# EAGLE design Platform (EAGLE 6.1)
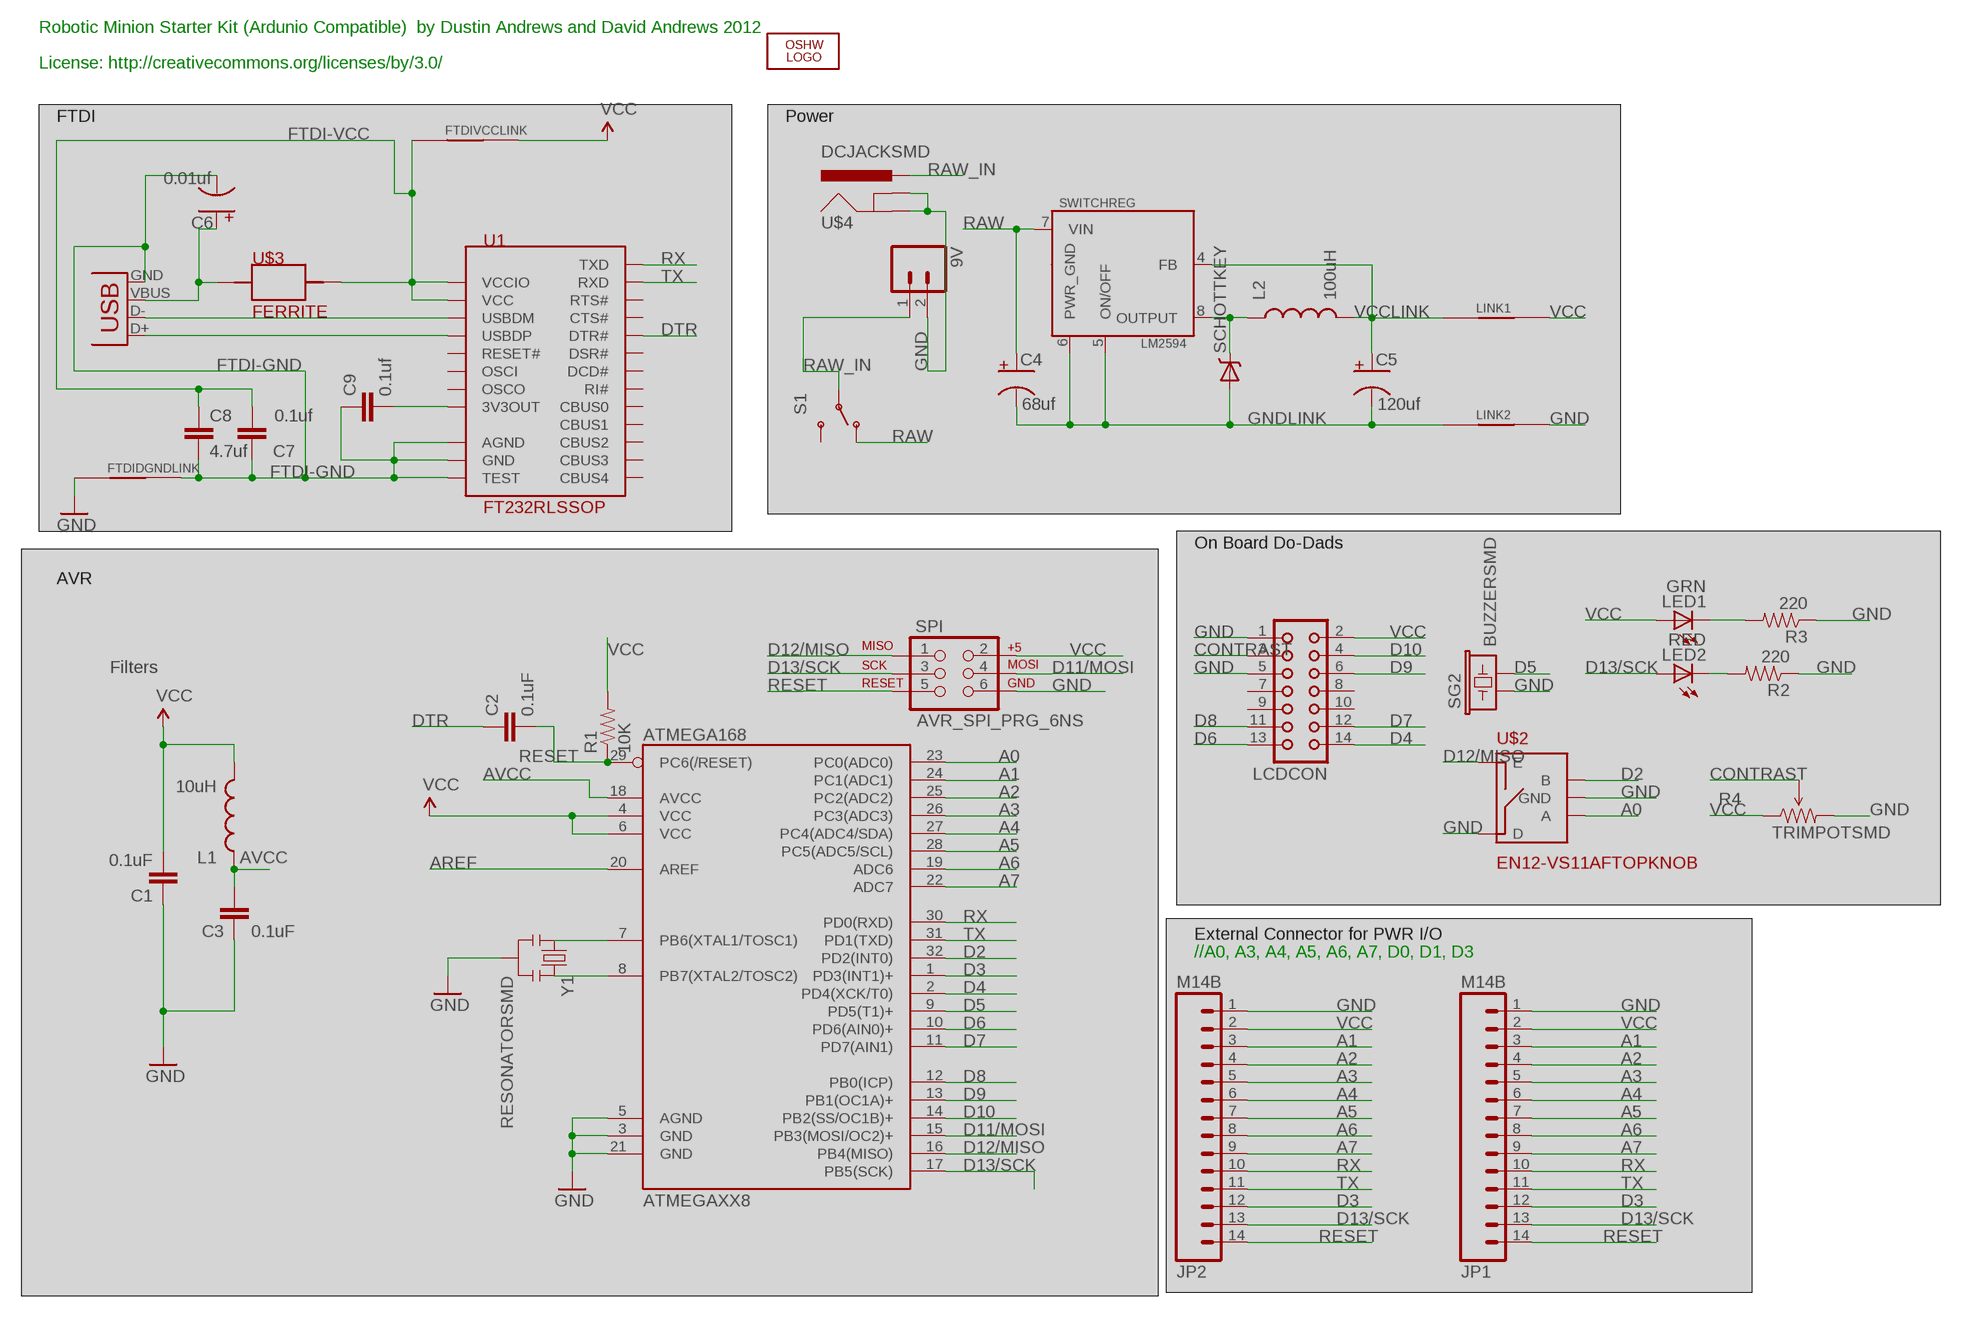
[diagram p0: schematic, sheet 1]

## Parts
9V  M02PTH  [1X02]
ATMEGAXX8  ATMEGA168  [TQFP32-08]
C1  0.1uF  CAP0805  [0805]
C2  0.1uF  CAP0805  [0805]
C3  0.1uF  CAP0805  [0805]
C4  68uf  CAP_POLF80  [F80]
C5  120uf  CAP_POL8X10  [10X8CAP]
C6  0.01uf  CAP_POL  [0805POL]
C7  0.1uf  CAP0805  [0805]
C8  4.7uf  CAP0805  [0805]
C9  0.1uf  CAP0805  [0805]
FTDIDGNDLINK  LINK  [ISOLATOR]
FTDIVCCLINK  LINK  [ISOLATOR]
JP1  M14B  [1X14B]
JP2  M14B  [1X14B]
L1  10uH  INDUCTOR0805  [0805]
L2  100uH  INDUCTOR0805  [0805]
LCDCON  CON14  [CON14]
LED1  GRN  LED0805  [LED-0805]
LED2  RED  LED0805  [LED-0805]
LINK1  LINK  [ISOLATOR]
LINK2  LINK  [ISOLATOR]
LOGO1  OSHW_LOGO_10MILX0750-NT  [OSHW_10X750_NOTEXT]
R1  10K  RESISTOR0805-RES  [0805]
R2  220  RESISTOR0805-RES  [0805]
R3  220  RESISTOR0805-RES  [0805]
R4  TRIMPOTSMD  [TRIMPOT-3MM]
S1  SWITCH-SPDT  [SWITCH-SPDT-SMT]
SCHOTTKEY  DIODE-SCHOTTKY  [SOD-123]
SG2  BUZZERSMD  [BUZZER-CMT1603]
SPI  AVR_SPI_PRG_6NS  [2X3-NS]
SWITCHREG  LM2594  [SOIC8]
U1  FT232RLSSOP  [SSOP28]
U$2  EN12-VS11AFTOPKNOB  [12MM_ROTATY_TOP]
U$3  FERRITE  [0805]
U$4  DCJACKSMD  [JACK-SMD]
X1  USBSMD  [USB-MINIB]
Y1  RESONATORSMD  [RESONATOR-SMD]

## Nets
3V3OUT: C9.2 U1.17(3V3OUT)
A0: ATMEGAXX8.23(PC0(ADC0)) U$2.A
A1: ATMEGAXX8.24(PC1(ADC1)) JP1.3 JP2.3
A2: ATMEGAXX8.25(PC2(ADC2)) JP1.4 JP2.4
A3: ATMEGAXX8.26(PC3(ADC3)) JP1.5 JP2.5
A4: ATMEGAXX8.27(PC4(ADC4/SDA)) JP1.6 JP2.6
A5: ATMEGAXX8.28(PC5(ADC5/SCL)) JP1.7 JP2.7
A6: ATMEGAXX8.19(ADC6) JP1.8 JP2.8
A7: ATMEGAXX8.22(ADC7) JP1.9 JP2.9
AREF: ATMEGAXX8.20(AREF)
AVCC: ATMEGAXX8.18(AVCC) C3.2 L1.1
CONTRAST: LCDCON.3 R4.2(WIPER)
D2: ATMEGAXX8.32(PD2(INT0)) U$2.B
D3: ATMEGAXX8.1(PD3(INT1)+) JP1.12 JP2.12
D4: ATMEGAXX8.2(PD4(XCK/T0)) LCDCON.14
D5: ATMEGAXX8.9(PD5(T1)+) SG2.P$2
D6: ATMEGAXX8.10(PD6(AIN0)+) LCDCON.13
D7: ATMEGAXX8.11(PD7(AIN1)) LCDCON.12
D8: ATMEGAXX8.12(PB0(ICP)) LCDCON.11
D9: ATMEGAXX8.13(PB1(OC1A)+) LCDCON.6
D10: ATMEGAXX8.14(PB2(SS/OC1B)+) LCDCON.4
D11/MOSI: ATMEGAXX8.15(PB3(MOSI/OC2)+) SPI.4
D12/MISO: ATMEGAXX8.16(PB4(MISO)) SPI.1 U$2.E
D13/SCK: ATMEGAXX8.17(PB5(SCK)) JP1.13 JP2.13 LED2.A SPI.3
D+: U1.15(USBDP) X1.D+
D-: U1.16(USBDM) X1.D-
DTR: C2.1 U1.2(DTR#)
FTDI-GND: C6.- C7.1 C8.2 C9.1 FTDIDGNDLINK.P$2 U1.7(GND) U1.18(GND) U1.21(GND) U1.25(AGND) U1.26(TEST) X1.GND
FTDI-VCC: C7.2 C8.1 FTDIVCCLINK.P$1 U1.4(VCCIO) U1.20(VCC) U$3.2
GND: 9V.2 ATMEGAXX8.3(GND) ATMEGAXX8.5(AGND) ATMEGAXX8.21(GND) C1.1 C3.1 FTDIDGNDLINK.P$1 JP1.1 JP2.1 LCDCON.1 LCDCON.5 LINK2.P$2 R2.1 R3.1 R4.3(CW) SG2.P$1 SPI.6 U$2.C(GND) U$2.D U$4.1A(GND) U$4.1B(GNDBREAK) Y1.2
GNDLINK: C4.- C5.- LINK2.P$1 SCHOTTKEY.ANODE(A) SWITCHREG.5(ON/OFF) SWITCHREG.6(PWR_GND)
N$2: LED2.C R2.2
N$3: L2.1 SCHOTTKEY.CATHODE(C) SWITCHREG.8(OUTPUT)
N$7: LED1.C R3.2
RAW: C4.+ S1.1(O) SWITCHREG.7(VIN)
RAW_IN: 9V.1 S1.2(P) U$4.2(PWR) U$4.3(PWR)
RESET: ATMEGAXX8.29(PC6(/RESET)) C2.2 JP1.14 JP2.14 R1.1 SPI.5
RX: ATMEGAXX8.30(PD0(RXD)) JP1.10 JP2.10 U1.1(TXD)
TX: ATMEGAXX8.31(PD1(TXD)) JP1.11 JP2.11 U1.5(RXD)
VBUS: C6.+ U$3.1 X1.VBUS
VCC: ATMEGAXX8.4(VCC) ATMEGAXX8.6(VCC) C1.2 FTDIVCCLINK.P$2 JP1.2 JP2.2 L1.2 LCDCON.2 LED1.A LINK1.P$2 R1.2 R4.1(CCW) SPI.2
VCCLINK: C5.+ L2.2 LINK1.P$1 SWITCHREG.4(FB)
XTAL1: ATMEGAXX8.7(PB6(XTAL1/TOSC1)) Y1.1
XTAL2: ATMEGAXX8.8(PB7(XTAL2/TOSC2)) Y1.3
Unconnected: LCDCON.7 LCDCON.8 LCDCON.9 LCDCON.10 S1.3(S) U1.3(RTS#) U1.6(RI#) U1.9(DSR#) U1.10(DCD#) U1.11(CTS#) U1.12(CBUS4) U1.13(CBUS2) U1.14(CBUS3) U1.19(RESET#) U1.22(CBUS1) U1.23(CBUS0) U1.27(OSCI) U1.28(OSCO)

## Notes on the sheet
- Robotic Minion Starter Kit (Ardunio Compatible)  by Dustin Andrews and David Andrews 2012
- License: http://creativecommons.org/licenses/by/3.0/
- FTDI | Power
- On Board Do-Dads
- AVR
- Filters
- External Connector for PWR I/O
- //A0, A3, A4, A5, A6, A7, D0, D1, D3

## Library data of the parts
9V = SparkFun:M02: Header 2 Standard 2-pin 0.1" header. Use with straight break away headers (SKU : PRT-00116), right angle break away headers (PRT-00553), swiss pins (PRT-00743), machine pins (PRT-00117), and female headers (PRT-00115). Molex polarized connector foot print use with SKU : PRT-08233 with associated crimp pins and housings.
ATMEGAXX8 = SparkFun:ATMEGA168
C1-C3 C7-C9 = SparkFun:CAP: Capacitor Standard 0603 ceramic capacitor, and 0.1" leaded capacitor.
C4-C6 = Dustin:CAP_POL: Polarized Capacitor
FTDIDGNDLINK FTDIVCCLINK LINK1 LINK2 = Dustin:LINK
JP1 JP2 = Dustin:M14B
L1 L2 = SparkFun:INDUCTOR: Inductors Basic Inductor/Choke - 0603 and 1206. Footprints are not proven and vary greatly between part numbers.
LCDCON = con-harting:CON14: CONNECTOR; OC_FARNELL: unknown; OC_NEWARK: unknown
LED1 LED2 = SparkFun:LED: LEDs Standard schematic elements and footprints for 5mm, 3mm, 1206, and 0603 sized LEDs. 5mm - Spark Fun Electronics SKU : COM-00529 (and others)
LOGO1 = ohw-logo:OSHW_LOGO_10MIL
R1-R3 = SparkFun:RESISTOR: Resistor Basic schematic elements and footprints for 0603, 1206, and PTH resistors.
R4 = SparkFun:TRIMPOT
S1 = Dustin:SWITCH-SPDT
SCHOTTKEY = Dustin:DIODE-SCHOTTKY
SG2 = SparkFun:BUZZER: Buzzer 12mm Spark Fun Electronics SKU : Comp-Buzzer
SPI = SparkFun:AVR_SPI_PRG_6: AVR ISP 6 Pin This is the reduced ISP connector for AVR programming. Common on Arduino. This footprint will take up less PCB space and can be used with a 10-pin to 6-pin adapter such as SKU: BOB-08508
SWITCHREG = Dustin:LM2594
U1 = Dustin:FT232RL: FT232RL FTDI USB to serial UART interface Digikey 768-1007-1-ND
U$2 = Dustin:EN12-VS11AF: 12mm Rotary Encoder with switch
U$3 = Dustin:FERRITE
U$4 = Dustin:DCJACK
X1 = SparkFun:USB: USB Connectors USB-B-PTH is fully proven SKU : PRT-00139 USB-miniB is fully proven SKU : PRT-00587 USB-A-PCB is untested. USB-A-H is throughly reviewed, but untested. Spark Fun Electronics SKU : PRT-00437 USB-B-SMT is throughly reviewed, but untested. Needs silkscreen touching up. USB-A-S has not been used/tested USB-MB-H has not been used/tested
Y1 = SparkFun:RESONATOR: Resonator Small SMD resonator. This is the itty bitty 10/20MHz resonators with built in caps. CSTCE10M0G55 and CSTCE20M0V53. Footprint has been reviewed closely but hasn't been tested yet.

## Board
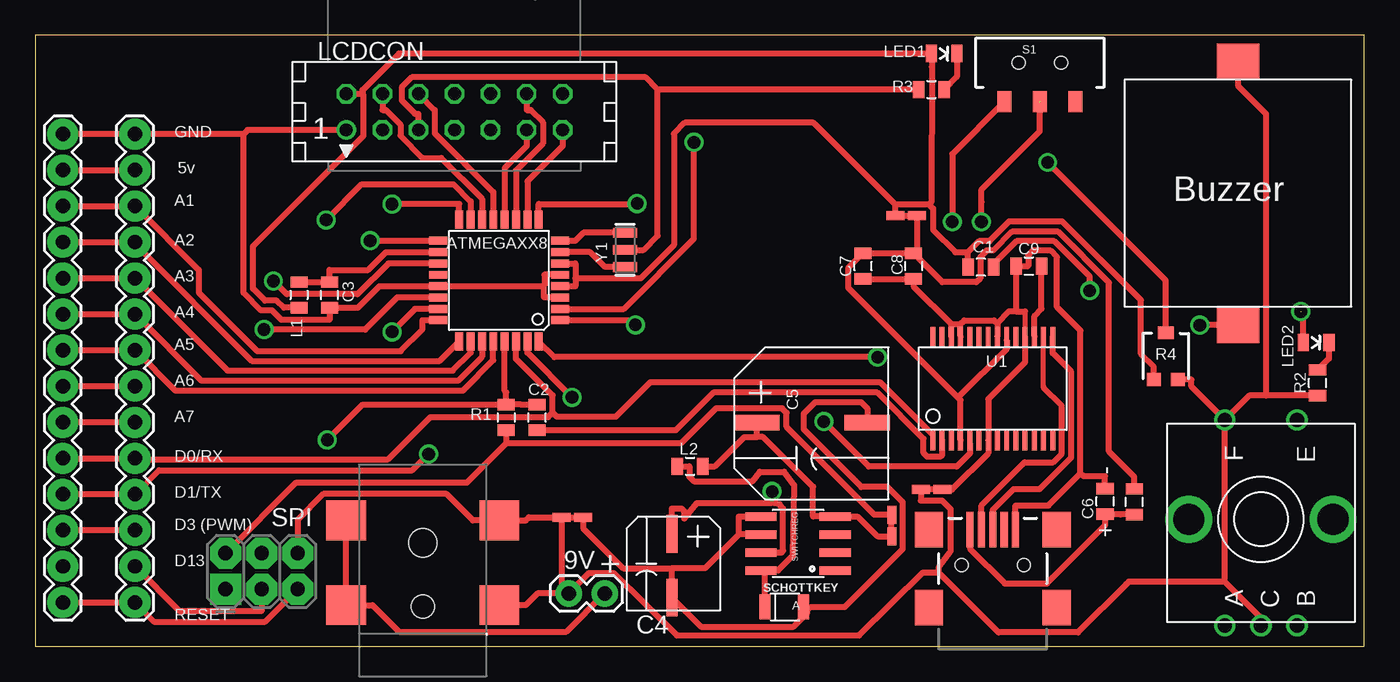
[diagram p1: board, top side]
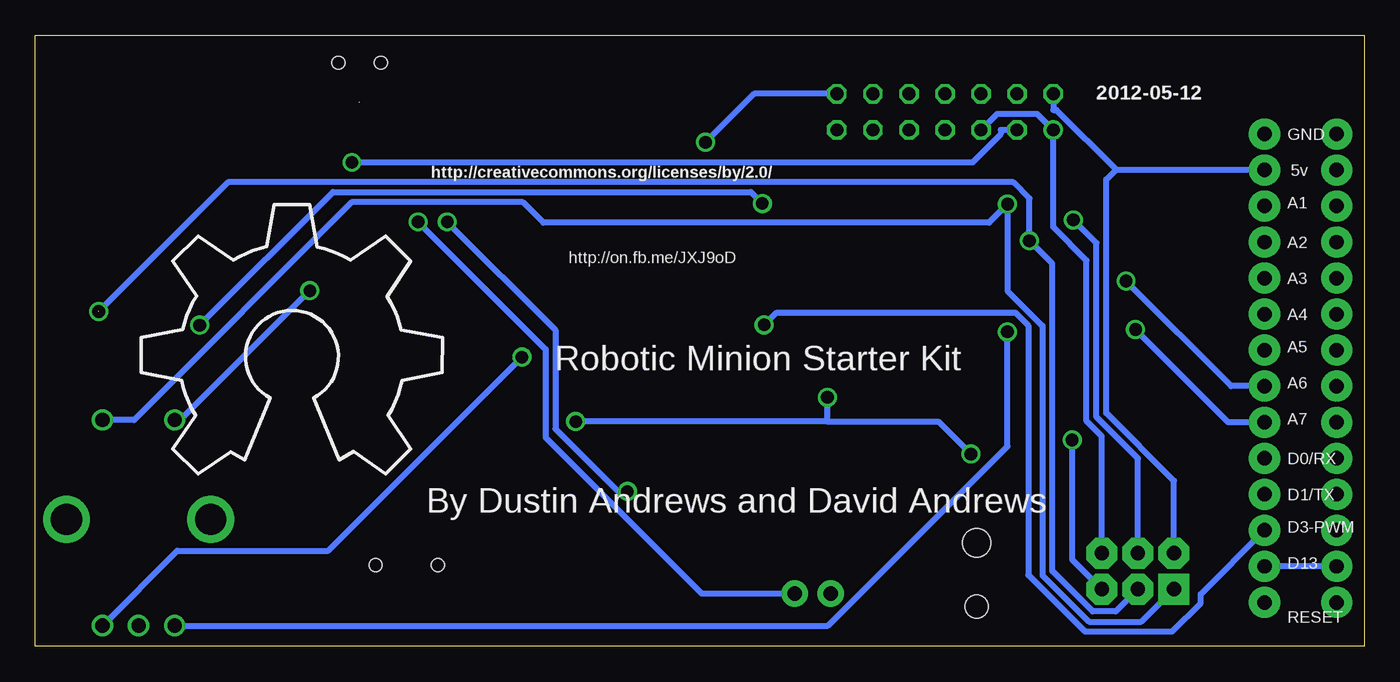
[diagram p2: board, bottom side, seen from below]

Size 93.62 x 43.05 mm. Coordinates in mm from the lower left corner, seen from the top.
Outline: 0,0 93.62,0 93.62,43.05 0,43.05 0,0
Copper layers (1*16): Top 0.0178mm / dielectric 59mil / Bottom 0.0178mm
Design rules: minimum track width 6mil, minimum drill 14mil, track to track 6mil, track to pad 6mil, pad to pad 6mil, via to via 6mil, smd to smd 6mil, copper to edge 20mil, drill to drill 16mil, minimum pad ring 8mil, minimum via ring 8mil, stop-mask expansion 3mil, vias tented up to drill 0mil, thermal gap 10mil
tRestrict: area 52.2,2.2 to 53.5,3.4; area 68.9,4.9 to 70.4,6.5; area 64.5,5 to 66,6.5
vRestrict: area 26.1,19.4 to 41.3,33.1; area 60.6,12.6 to 74.1,24

### Footprints (pad centres in the part's own frame; a part is rotated, then mirrored left to right if it is on the bottom)
1X02 = drill 1.016 pad 1.88: 1 0,0; 2 2.54,0
TQFP32-08 = smd 1.27 x 0.559: 1 -4.293,2.8; 2 -4.293,2; 3 -4.293,1.2; 4 -4.293,0.4; 5 -4.293,-0.4; 6 -4.293,-1.2; 7 -4.293,-2; 8 -4.293,-2.8; 17 4.293,-2.8; 18 4.293,-2; 19 4.293,-1.2; 20 4.293,-0.4; 21 4.293,0.4; 22 4.293,1.2; 23 4.293,2; 24 4.293,2.8 | smd 0.559 x 1.27: 9 -2.8,-4.293; 10 -2,-4.293; 11 -1.2,-4.293; 12 -0.4,-4.293; 13 0.4,-4.293; 14 1.2,-4.293; 15 2,-4.293; 16 2.8,-4.293; 25 2.8,4.293; 26 2,4.293; 27 1.2,4.293; 28 0.4,4.293; 29 -0.4,4.293; 30 -1.2,4.293; 31 -2,4.293; 32 -2.8,4.293
0805 = smd 0.8 x 1.2: 1 -0.9,0; 2 0.9,0
F80 = smd 0.8 x 2.65: + 0,2.2; - 0,-2.3
10X8CAP = smd 1.1 x 3.2: + 0.39,4.19; - 0.39,-3.61
0805POL = smd 0.8 x 1.2: + -0.9,0; - 0.9,0
ISOLATOR = smd 1.27 x 0.635: P$1 -0.762,0; P$2 0.762,0
1X14B = drill 1.016 pad 2.184: 1 0,0; 2 2.54,0; 3 5.08,0; 4 7.62,0; 5 10.16,0; 6 12.7,0; 7 15.24,0; 8 17.78,0; 9 20.32,0; 10 22.86,0; 11 25.4,0; 12 27.94,0; 13 30.48,0; 14 33.02,0
CON14 = drill 0.914: 1 -7.62,-1.27 | drill 0.914 octagon: 2 -7.62,1.27; 3 -5.08,-1.27; 4 -5.08,1.27; 5 -2.54,-1.27; 6 -2.54,1.27; 7 0,-1.27; 8 0,1.27; 9 2.54,-1.27; 10 2.54,1.27; 11 5.08,-1.27; 12 5.08,1.27; 13 7.62,-1.27; 14 7.62,1.27
LED-0805 = smd 0.8 x 1.2: A -0.9,0; C 0.9,0
TRIMPOT-3MM = smd 1 x 0.9: 1 -0.85,-1.65; 3 0.85,-1.65 | smd 1.1 x 0.9: 2 0,1.65
SWITCH-SPDT-SMT = smd 1 x 1.5: 1 -2.5,-2.75; 2 0,-2.75; 3 2.5,-2.75 | hole 0.9: -1.5,0; 1.5,0
SOD-123 = smd 0.762 x 1.778: ANODE 1.384,0.1; CATHODE -1.316,0.1
BUZZER-CMT1603 = smd 2.5 x 3: P$1 -9.3,0; P$2 9.3,0
2X3-NS = drill 1.016 pad 2.184 square: 1 -2.54,-1.27 | drill 1.016 pad 2.184 octagon: 2 -2.54,1.27; 3 0,-1.27; 4 0,1.27; 5 2.54,-1.27; 6 2.54,1.27
SOIC8 = smd 0.61 x 2.21: 1 -1.905,-2.616; 2 -0.635,-2.616; 3 0.635,-2.616; 4 1.905,-2.616; 5 1.905,2.616; 6 0.635,2.616; 7 -0.635,2.616; 8 -1.905,2.616
SSOP28 = smd 0.348 x 1.397: 1 -4.225,-3.656; 2 -3.575,-3.656; 3 -2.925,-3.656; 4 -2.275,-3.656; 5 -1.625,-3.656; 6 -0.975,-3.656; 7 -0.325,-3.656; 8 0.325,-3.656; 9 0.975,-3.656; 10 1.625,-3.656; 11 2.275,-3.656; 12 2.925,-3.656; 13 3.575,-3.656; 14 4.225,-3.656; 15 4.225,3.656; 16 3.575,3.656; 17 2.925,3.656; 18 2.275,3.656; 19 1.625,3.656; 20 0.975,3.656; 21 0.325,3.656; 22 -0.325,3.656; 23 -0.975,3.656; 24 -1.625,3.656; 25 -2.275,3.656; 26 -2.925,3.656; 27 -3.575,3.656; 28 -4.225,3.656
12MM_ROTATY_TOP = drill 1: A 0,-2.54; B 0,2.54; C 0,0; D -14.5,-2.54; E -14.5,2.54 | drill 2.2: NC1 -7.5,-5.08; NC2 -7.5,5.08
JACK-SMD = smd 2.8 x 2.8: 1A 5.4,11.07; 1B 5.4,5.1; 2 -5.4,11.07; 3 -5.4,5.1 | hole 1.6: 0,5 | hole 2: 0,9.5
USB-MINIB = smd 2.5 x 0.5: D+ 2.5,0; D- 2.5,0.8; GND 2.5,-1.6; ID 2.5,-0.8; VBUS 2.5,1.6 | smd 2.5 x 2: MTN1 -3,4.5; MTN2 2.5,4.5; MTN3 -3,-4.5; MTN4 2.5,-4.5 | hole 0.9: 0,2.2; 0,-2.2
RESONATOR-SMD = smd 0.7 x 1.7: 1 -1.2,0; 2 0,0; 3 1.2,0

### Placement (x,y rotation side)
9V  40.11,3.72 180 top
ATMEGAXX8  32.66,25.78 180 top
C1  66.62,26.72 180 top
C2  35.35,16.12 90 top
C3  20.73,24.77 90 top
C4  44.86,5.71 0 top
C5  55.02,15.37 90 top
C6  75.38,10.22 90 top
C7  58.32,26.8 90 top
C8  61.87,26.8 270 top
C9  70,26.8 0 top
FTDIDGNDLINK  63.14,11.05 0 top
FTDIVCCLINK  61.37,30.35 180 top
JP1  1.93,36.11 270 top
JP2  7.01,36.11 270 top
L1  18.57,24.77 270 top
L2  46.13,12.69 0 top
LCDCON  29.53,37.66 0 top
LED1  64.03,41.78 0 top
LED2  90.25,21.41 0 top
LINK1  60.35,8.51 90 top
LINK2  37.84,9.09 180 top
LOGO1  86.18,12.12 0 bottom
R1  33.17,16.13 270 top
R2  90.35,18.57 90 top
R3  63.14,39.24 0 top
R4  79.65,20.45 0 top
S1  70.78,41.13 0 top
SCHOTTKEY  52.73,2.67 0 top
SG2  84.73,31.93 270 top
SPI  15.94,5.28 0 top
SWITCHREG  53.75,7.24 90 top
U1  67.46,18.16 0 top
U$2  86.36,1.45 270 top
U$3  77.43,10.18 90 top
U$4  27.3,-2.21 0 top
X1  67.46,5.71 90 top
Y1  41.55,27.94 90 top

### Tracks (layer width: path | path; a pad name or v marks a point on that pad's centre or on a via)
3V3OUT
  Top 0.348: U1.17
  Top 0.406: U1.17 70.4,23.29 70.9,23.79 C9.2
A0  (via drill 0.89 pad 1.33)
  Top 0.406: ATMEGAXX8.23 26.75,23.78 v25.13,22.16
  Bottom 0.406: U$2.A 37.77,1.45 25.13,14.09 v25.13,22.16
A1
  Top 0.406: JP1.3 JP2.3 11.52,26.52 11.52,24.92 15.64,20.8 25.75,20.8 27.28,22.34 27.28,22.98 ATMEGAXX8.24
A2
  Top 0.406: JP1.4 JP2.4 7.01,28.35 15.25,20.12 28.49,20.12 ATMEGAXX8.25
A3
  Top 0.406: JP1.5 JP2.5 13.54,19.42 29.4,19.42 30.66,20.68 ATMEGAXX8.26
A4
  Top 0.406: JP1.6 JP2.6 11.71,18.71 29.78,18.71 31.46,20.4 ATMEGAXX8.27
A5
  Top 0.406: JP1.7 JP2.7 9.86,18.02 30.12,18.02 32.26,20.16 ATMEGAXX8.28
A6  (via drill 0.89 pad 1.33)
  Top 0.406: JP1.8 JP2.8 | ATMEGAXX8.19 24.87,26.98 22.7,24.81 17.71,24.81 v16.77,25.74
  Bottom 0.406: JP2.8 9.35,18.33 v16.77,25.74
A7  (via drill 0.89 pad 1.33)
  Top 0.406: JP2.9 JP1.9 | ATMEGAXX8.22 25.5,24.58 23.24,22.32 v16.1,22.32
  Bottom 0.406: JP2.9 9.57,15.79 v16.1,22.32
AVCC
  Top 0.406: L1.1 C3.2 20.73,26.52 23.44,26.52 24.7,27.78 ATMEGAXX8.18
CONTRAST  (via drill 0.89 pad 1.33)
  Top 0.406: R4.2 79.65,25.78 v71.33,34.1
  Bottom 0.406: LCDCON.3 25.59,36.4 25.59,36.11 27.6,34.1 v71.33,34.1
D2  (via drill 0.89 pad 1.33)
  Top 0.406: v59.34,20.37 36.58,20.37 ATMEGAXX8.32
  Bottom 0.406: U$2.B 83.62,6.72 72.99,6.72 v59.34,20.37
D3  (via drill 0.89 pad 1.33)
  Top 0.406: JP2.12 JP1.12 | ATMEGAXX8.1 41.94,22.98 v42.27,22.65
  Bottom 0.406: v42.27,22.65 41.4,23.52 24.57,23.52 23.66,22.61 23.66,5.02 19.67,1.03 13.52,1.03 11.52,3.04 11.52,3.66 JP2.12
D4  (via drill 0.89 pad 1.33)
  Top 0.406: ATMEGAXX8.2 41.47,23.78 46.4,28.72 v46.4,35.52
  Bottom 0.406: LCDCON.14 42.99,38.94 v46.4,35.52
D5  (via drill 0.89 pad 1.33)
  Top 0.406: ATMEGAXX8.9 35.46,31.17 42.35,31.17 v42.4,31.21 | SG2.P$2 v82.05,22.63
  Bottom 0.406: v82.05,22.63 72.65,32.03 43.21,32.03 v42.4,31.21
D6
  Top 0.406: LCDCON.13 37.15,35.25 34.66,32.77 ATMEGAXX8.10
D7
  Top 0.406: LCDCON.12 34.61,37.79 34.89,37.79 35.75,36.93 35.75,35.43 33.86,33.54 ATMEGAXX8.11
D8
  Top 0.406: LCDCON.11 34.61,35.25 33.06,33.71 ATMEGAXX8.12
D9
  Top 0.406: LCDCON.6 28.13,37.79 28.13,36.15 32.26,32.02 ATMEGAXX8.13
D10
  Top 0.406: LCDCON.4 24.45,37.79 24.7,37.79 25.72,36.78 25.72,35.99 27.29,34.42 28.59,34.42 31.46,31.55 ATMEGAXX8.14
D11/MOSI  (via drill 0.89 pad 1.33)
  Top 0.406: v20.48,30.05 23,32.57 29.45,32.57 30.66,31.36 ATMEGAXX8.15
  Bottom 0.406: SPI.4 15.94,13.23 18.86,16.15 18.86,28.43 v20.48,30.05
D12/MISO  (via drill 0.89 pad 1.33)
  Top 0.406: ATMEGAXX8.16 29.86,31.17 v25.12,31.17
  Bottom 0.406: SPI.1 15.69,1.72 19.39,1.72 22.66,4.99 22.66,22.58 25.12,25.05 v25.12,31.17 26.43,29.86 57.83,29.86 59.26,31.29 71.34,31.29 86.68,15.95 U$2.E
D13/SCK  (via drill 0.89 pad 1.33)  (1 unrouted)
  Top 0.406: SPI.3 15.94,2.46 10.18,2.46 JP2.13 | v23.58,28.58 ATMEGAXX8.17 | LED2.A 89.35,23.45 89.2,23.6
  Bottom 0.406: SPI.3 17.5,2.45 19.11,2.45 21.97,5.31 21.97,26.97 v23.58,28.58 23.58,31.57 24.73,32.71 80.05,32.71 v89.17,23.59 | JP1.13 JP2.13
D+
  Top 0.406: X1.D+ 67.46,9.6 68.94,11.08 70.77,11.08 72.99,13.3 72.99,19.36 71.69,20.66 U1.15
D-
  Top 0.348: 71.04,18.24 U1.16
  Top 0.406: X1.D- 66.66,9.92 69.7,12.96 71.72,12.96 72.32,13.56 72.32,16.96 71.04,18.24
DTR
  Top 0.406: U1.2 63.89,13.47 63.77,13.35 62.84,13.35 62.58,13.62 62.58,14.62 59.32,17.87 47.77,17.87 45.12,15.22 C2.1
FTDI-GND
  Top 0.348: 69.74,23.59 U1.18 | 67.77,21.83 U1.21
  Top 0.406: 65.19,22.7 65.46,22.97 67.55,22.97 67.77,22.75 | U1.25 65.19,22.7 | 64.54,22.7 65.19,22.7 | X1.GND 69.06,9.92 71.38,9.92 73.65,12.19 | C6.- 75.38,11.97 73.87,11.97 73.65,12.19 | 73.65,12.19 73.65,22.24 71.99,23.9 71.99,27.43 71.54,27.87 70.29,27.87 69.96,27.55 69.96,26.8 C9.1 69.1,23.59 | FTDIDGNDLINK.P$2 64.59,11.05 67.14,13.6 U1.7 67.14,17.41 69.74,20.01 U1.18 | C7.1 C8.2 61.87,25.36 64.54,22.7 | U1.26 64.54,22.7 | 69.1,23.59 69.74,23.59 | 69.1,23.59 68.61,23.59 67.77,22.75 | 67.77,22.75 67.77,21.83
FTDI-VCC
  Top 0.348: 68.46,21.55 68.46,21.8 U1.20
  Top 0.406: U$3.2 77.43,11.94 75.65,13.72 75.65,25.63 72.07,29.21 68.82,29.21 67.5,27.89 67.04,27.89 66.58,27.43 66.58,25.93 66.31,25.66 63.91,25.66 C8.1 | U1.4 65.19,17.34 65.01,17.52 | 68.46,21.55 68.46,20.96 65.01,17.52 | 65.01,17.52 57.26,25.27 57.26,26.64 C7.2 C8.1 | FTDIVCCLINK.P$1 62.13,27.95 C8.1
GND  (via drill 0.89 pad 1.33)
  Top 0.406: FTDIDGNDLINK.P$1 62.38,10.27 63.88,10.27 64.48,9.67 64.48,6.69 63.65,5.55 63.65,5.19 | 63.65,5.19 67.87,0.97 73.46,0.97 76.86,4.36 77.04,4.54 83.82,4.54 | 83.82,4.54 U$2.D | U$2.C 86.36,2 83.82,4.54 | LCDCON.5 26.99,37.54 26.75,37.54 25.82,38.47 25.82,39.4 26.52,40.1 43,40.1 43.85,39.24 | ATMEGAXX8.3 35.86,24.58 35.81,24.64 35.81,25.38 | ATMEGAXX8.5 35.86,26.18 35.86,25.44 35.81,25.38 | Y1.2 42.86,27.94 43.85,28.93 43.85,39.24 | v74.29,25.07 74.29,26.06 71.8,28.55 69.13,28.55 67.52,26.94 C1.1 | JP1.1 JP2.1 14.65,36.11 | 37.08,3.72 LINK2.P$2 34.78,9.09 34.55,8.86 U$4.1A 30.84,8.86 28.98,10.72 20.28,10.72 18.48,8.92 SPI.6 | 37.08,3.72 9V.2 39.01,5.15 40.74,5.15 45.21,0.76 58.04,0.76 62.54,5.19 63.65,5.19 | 37.08,3.72 35.38,3.72 34.55,2.89 U$4.1B | R2.1 86.72,17.67 | 14.65,36.11 14.65,24.91 15.88,23.68 16.67,23.68 17.34,23.01 20.73,23.01 C3.1 22.73,23.86 24.24,25.38 ATMEGAXX8.21 35.81,25.38 | LCDCON.1 14.94,36.4 14.65,36.11 | R3.1 43.85,39.24 | SG2.P$1 84.73,39.52 86.72,37.54 86.72,17.67 | U$2.D 81.46,18.31 81.46,18.8 R4.3 | 86.72,17.67 85.54,17.67 U$2.D
  Bottom 0.406: U$2.D 83.41,15.95 v74.29,25.07 | LCDCON.5 25.84,37.54 23.05,37.54 LCDCON.1 21.91,29.56 19.55,27.2 19.55,15.87 18.48,14.8 SPI.6
GNDLINK
  Top 0.406: 44.86,5.5 C4.- 46.9,1.37 53.42,1.37 54.37,2.33 54.37,2.51 | LINK2.P$1 38.6,8.31 41.42,5.5 44.86,5.5 | 49.57,7.87 49.57,9.14 SWITCHREG.5 | SWITCHREG.6 49.57,7.87 | 49.57,7.87 47.19,5.5 44.86,5.5 | 54.37,2.51 54.63,2.77 57.04,2.77 61.13,6.85 61.13,10.14 60.05,11.23 58.2,11.23 54.15,15.28 54.15,16.39 54.96,17.21 58.18,17.21 58.63,16.76 C5.- | 54.37,2.51 SCHOTTKEY.ANODE
N$2
  Top 0.406: LED2.C 91.15,20.27 R2.2
N$3
  Top 0.406: L2.1 46.08,12.69 46.08,11.94 46.39,11.63 50.54,11.63 51.04,12.29 52.76,12.29 53.46,11.34 53.36,6.36 52.33,5.33 51.41,5.33 | SCHOTTKEY.CATHODE 51.41,5.33 | SWITCHREG.8 51.41,5.33
N$7
  Top 0.406: LED1.C 64.93,40.13 R3.2
RAW  (via drill 0.89 pad 1.33)
  Top 0.406: S1.1 64.6,34.7 v64.6,29.91 | SWITCHREG.7 52.57,6.6 52.69,6.72 52.69,9.69 52.45,10.01 51.87,10.09 | C4.+ 44.86,9.7 45.53,9.7 45.71,9.52 45.71,8.98 46.61,10.09 51.87,10.09 | 51.87,10.09 v51.92,10.9
  Bottom 0.406: v64.6,29.91 56.98,22.29 56.98,15.33 52.27,10.62 v51.92,10.9
RAW_IN  (via drill 0.89 pad 1.33)  (1 unrouted)
  Top 0.406: v66.66,29.91 66.66,31.32 66.66,32.2 70.76,36.3 70.76,38.3 70.82,38.35 | U$4.2 U$4.3 23.75,2.89 25.63,1.01 37.41,1.01 9V.1
  Bottom 0.406: v66.66,29.91 57.67,20.92 57.67,14.7 46.68,3.72 9V.1
RESET  (via drill 0.89 pad 1.33)
  Top 0.406: C2.2 34.24,17.02 34.23,17.03 R1.1 | R1.1 33.17,17.89 33.06,17.99 ATMEGAXX8.29 | SPI.5 16.2,1.73 8.37,1.73 JP2.14 JP1.14 | v20.56,14.54 23.06,17.03 R1.1
  Bottom 0.406: SPI.5 20.56,6.1 v20.56,14.54
RX
  Top 0.348: 63.23,14.9 63.23,14.52 U1.1
  Top 0.406: JP1.10 JP2.10 7.08,13.18 24.85,13.18 27.83,16.16 36.14,16.16 36.44,16.46 | 36.44,16.46 36.44,17.68 33.86,20.26 ATMEGAXX8.30 | 36.44,16.46 36.72,16.18 40.9,16.18 43.34,18.62 59.5,18.62 63.23,14.9
TX  (via drill 0.89 pad 1.33)
  Top 0.348: 65.86,14.24 65.86,14.49 U1.5
  Top 0.406: JP1.11 JP2.11 8.7,12.4 26.56,12.4 v27.71,13.54 | 65.86,14.24 65.86,13.6 64.93,12.67 58.72,12.67 v55.56,15.83 | v37.82,17.54 34.66,20.7 ATMEGAXX8.31
  Bottom 0.406: 37.82,15.83 v37.82,17.54 | 37.82,15.83 v55.56,15.83 | 37.82,15.83 29.99,15.83 v27.71,13.54
VBUS
  Top 0.406: X1.VBUS 65.86,6.87 68.3,4.43 71.28,4.43 75.38,8.53 C6.+ 76.44,9.32 76.47,9.28 U$3.1
VCC
  Top 0.406: ATMEGAXX8.4 38.05,25.38 38.05,25.93 | ATMEGAXX8.6 38.05,26.98 38.05,25.93 | 60.6,31.13 54.84,36.89 45.75,36.89 44.98,36.12 44.98,28.27 42.65,25.93 38.05,25.93 | 62.97,31.13 63.13,31.29 63.16,40.82 LED1.A 25.61,41.78 23.04,39.21 23.04,38.94 | R4.1 78.8,19.7 77.9,20.61 77.9,24.39 72.35,29.94 68.61,29.94 67.23,28.55 66.49,28.55 65.72,27.78 | C1.2 65.72,27.78 | R1.2 33.17,14.3 | LINK1.P$2 59.12,9.27 52.93,15.46 52.93,16.45 52.62,16.76 47.96,16.76 45.5,14.3 33.17,14.3 | JP1.2 JP2.2 | LCDCON.2 23.04,38.94 | SPI.2 18.38,11.53 30.4,11.53 33.17,14.3 | 62.97,31.13 63.25,30.85 63.25,29.35 64.82,27.78 65.72,27.78 | L1.2 17.51,23.86 17.01,24.36 16.17,24.36 15.34,25.2 15.34,28.2 23.11,35.97 23.11,38.87 23.04,38.94 | FTDIVCCLINK.P$2 60.6,31.13 | 62.97,31.13 60.6,31.13
  Bottom 0.406: LCDCON.2 21.91,37.79 21.67,37.79 17.5,33.62 17.5,33.57 | SPI.2 13.4,11.66 18.17,16.43 18.17,32.9 17.5,33.57 | JP2.2 17.5,33.57
VCCLINK
  Top 0.406: C5.+ 50.83,14.75 | LINK1.P$1 59.32,7.75 57.92,9.14 SWITCHREG.4 54.8,9.14 54.8,11.23 51.28,14.75 50.83,14.75 | L2.2 47.88,12.69 49.95,14.75 50.83,14.75
XTAL1
  Top 0.406: Y1.1 40.14,26.74 39.1,27.78 ATMEGAXX8.7
XTAL2
  Top 0.406: ATMEGAXX8.8 38.05,28.58 38.61,29.14 Y1.3

### Text on the board
tPlace: Buzzer
tNames: GND | 5v | A1 | A2 | A3 | A4 | A5 | A6 | A7 | D0/RX | D1/TX | D3 (PWM) | D13 | + | RESET
bNames: 2012-05-12 | GND | 5v | http://creativecommons.org/licenses/by/2.0/ | A1 | A2 | http://on.fb.me/JXJ9oD | A3 | A4 | A5 | Robotic Minion Starter Kit | A6 | A7 | D0/RX | D1/TX | By Dustin Andrews and David Andrews | D3-PWM | D13 | RESET